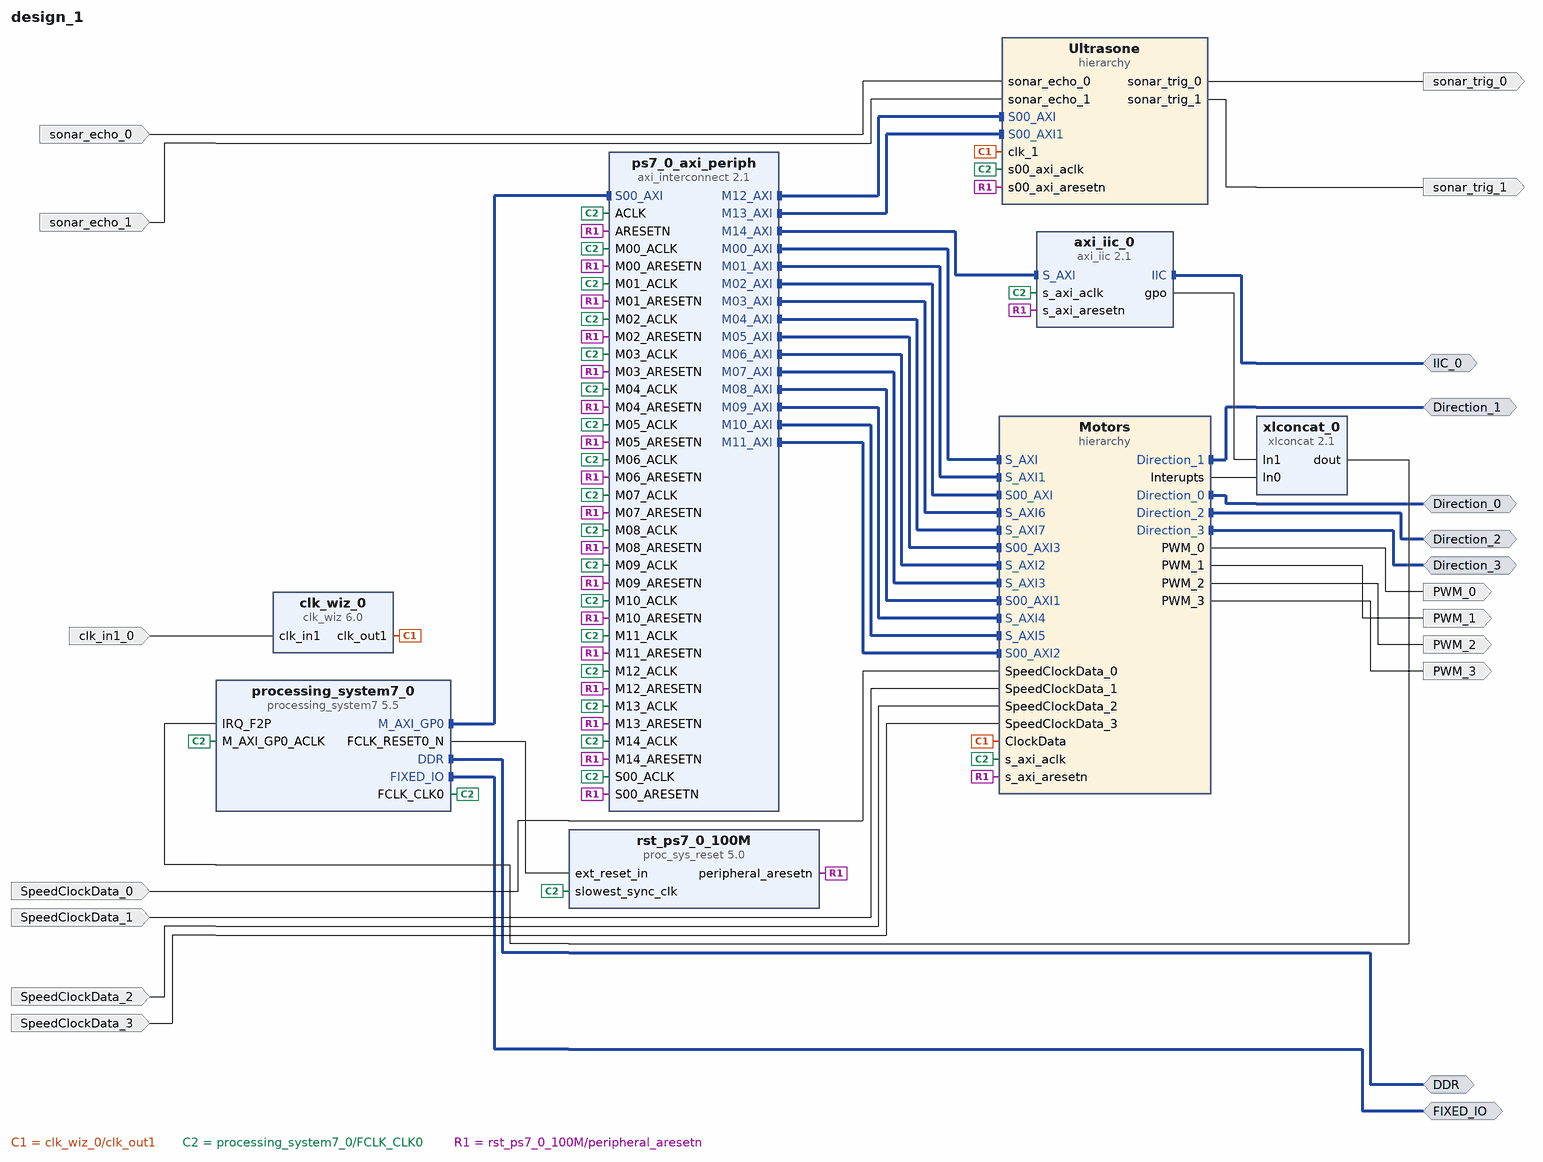
[diagram p0: block diagram of the top level]
# Vivado block design design_1, xc7z020clg400-1, Vivado 2023.2
create_bd_design design_1

create_bd_intf_port -mode Master -vlnv xilinx.com:interface:gpio_rtl:1.0 Direction_0
create_bd_intf_port -mode Master -vlnv xilinx.com:interface:ddrx_rtl:1.0 DDR
create_bd_intf_port -mode Master -vlnv xilinx.com:display_processing_system7:fixedio_rtl:1.0 FIXED_IO
create_bd_intf_port -mode Master -vlnv xilinx.com:interface:gpio_rtl:1.0 Direction_1
create_bd_intf_port -mode Master -vlnv xilinx.com:interface:gpio_rtl:1.0 Direction_2
create_bd_intf_port -mode Master -vlnv xilinx.com:interface:gpio_rtl:1.0 Direction_3
create_bd_intf_port -mode Master -vlnv xilinx.com:interface:iic_rtl:1.0 IIC_0
create_bd_port -dir I SpeedClockData_0
create_bd_port -dir O sonar_trig_0
create_bd_port -dir I sonar_echo_0
create_bd_port -dir O sonar_trig_1
create_bd_port -dir I sonar_echo_1
create_bd_port -dir I -type clk clk_in1_0
set_property -dict {CONFIG.FREQ_HZ 125000000} [get_bd_ports clk_in1_0]
create_bd_port -dir O PWM_0
create_bd_port -dir O PWM_3
create_bd_port -dir O PWM_2
create_bd_port -dir O PWM_1
create_bd_port -dir I SpeedClockData_3
create_bd_port -dir I SpeedClockData_2
create_bd_port -dir I SpeedClockData_1

create_bd_cell -type ip -vlnv xilinx.com:ip:processing_system7:5.5 processing_system7_0
set_property -dict [list \
  CONFIG.PCW_APU_PERIPHERAL_FREQMHZ 650 \
  CONFIG.PCW_CRYSTAL_PERIPHERAL_FREQMHZ 50 \
  CONFIG.PCW_ENET0_ENET0_IO {MIO 16 .. 27} \
  CONFIG.PCW_ENET0_GRP_MDIO_ENABLE 1 \
  CONFIG.PCW_ENET0_GRP_MDIO_IO {MIO 52 .. 53} \
  CONFIG.PCW_ENET0_PERIPHERAL_ENABLE 1 \
  CONFIG.PCW_ENET0_RESET_ENABLE 1 \
  CONFIG.PCW_ENET0_RESET_IO {MIO 9} \
  CONFIG.PCW_ENET_RESET_ENABLE 1 \
  CONFIG.PCW_ENET_RESET_SELECT {Share reset pin} \
  CONFIG.PCW_FPGA0_PERIPHERAL_FREQMHZ 100 \
  CONFIG.PCW_FPGA1_PERIPHERAL_FREQMHZ 50 \
  CONFIG.PCW_GPIO_MIO_GPIO_ENABLE 1 \
  CONFIG.PCW_GPIO_MIO_GPIO_IO MIO \
  CONFIG.PCW_I2C_RESET_ENABLE 1 \
  CONFIG.PCW_IRQ_F2P_INTR 1 \
  CONFIG.PCW_M_AXI_GP0_FREQMHZ 10 \
  CONFIG.PCW_PERIPHERAL_BOARD_PRESET part0 \
  CONFIG.PCW_PRESET_BANK1_VOLTAGE {LVCMOS 1.8V} \
  CONFIG.PCW_QSPI_GRP_FBCLK_ENABLE 1 \
  CONFIG.PCW_QSPI_GRP_FBCLK_IO {MIO 8} \
  CONFIG.PCW_QSPI_GRP_SINGLE_SS_ENABLE 1 \
  CONFIG.PCW_QSPI_GRP_SINGLE_SS_IO {MIO 1 .. 6} \
  CONFIG.PCW_QSPI_PERIPHERAL_ENABLE 1 \
  CONFIG.PCW_QSPI_QSPI_IO {MIO 1 .. 6} \
  CONFIG.PCW_SD0_GRP_CD_ENABLE 1 \
  CONFIG.PCW_SD0_GRP_CD_IO {MIO 47} \
  CONFIG.PCW_SD0_GRP_WP_ENABLE 0 \
  CONFIG.PCW_SD0_PERIPHERAL_ENABLE 1 \
  CONFIG.PCW_SD0_SD0_IO {MIO 40 .. 45} \
  CONFIG.PCW_SDIO_PERIPHERAL_FREQMHZ 50 \
  CONFIG.PCW_SINGLE_QSPI_DATA_MODE x4 \
  CONFIG.PCW_UART0_PERIPHERAL_ENABLE 1 \
  CONFIG.PCW_UART0_UART0_IO {MIO 14 .. 15} \
  CONFIG.PCW_UART1_PERIPHERAL_ENABLE 0 \
  CONFIG.PCW_UART_PERIPHERAL_FREQMHZ 100 \
  CONFIG.PCW_UIPARAM_DDR_BUS_WIDTH {16 Bit} \
  CONFIG.PCW_UIPARAM_DDR_FREQ_MHZ 525 \
  CONFIG.PCW_UIPARAM_DDR_PARTNO {MT41J256M16 RE-125} \
  CONFIG.PCW_USB0_PERIPHERAL_ENABLE 1 \
  CONFIG.PCW_USB0_RESET_ENABLE 1 \
  CONFIG.PCW_USB0_RESET_IO {MIO 46} \
  CONFIG.PCW_USB0_USB0_IO {MIO 28 .. 39} \
  CONFIG.PCW_USB_RESET_ENABLE 1 \
  CONFIG.PCW_USB_RESET_SELECT {Share reset pin} \
  CONFIG.PCW_USE_FABRIC_INTERRUPT 1 \
] [get_bd_cells processing_system7_0]
# 495 more settings of processing_system7_0 are not shown: defaults, MIO pin electricals, DDR timing, and values the tool derives
create_bd_cell -type ip -vlnv xilinx.com:ip:proc_sys_reset:5.0 rst_ps7_0_100M
create_bd_cell -type ip -vlnv xilinx.com:ip:axi_interconnect:2.1 ps7_0_axi_periph
set_property -dict {CONFIG.NUM_MI 15} [get_bd_cells ps7_0_axi_periph]
create_bd_cell -type hier Ultrasone
create_bd_cell -type ip -vlnv xilinx.com:ip:clk_wiz:6.0 clk_wiz_0
set_property -dict [list \
  CONFIG.CLKIN1_JITTER_PS 80.0 \
  CONFIG.CLKOUT1_JITTER 124.615 \
  CONFIG.CLKOUT1_PHASE_ERROR 96.948 \
  CONFIG.MMCM_CLKFBOUT_MULT_F 8.000 \
  CONFIG.MMCM_CLKIN1_PERIOD 8.000 \
  CONFIG.PRIM_IN_FREQ 125.000 \
  CONFIG.USE_LOCKED false \
  CONFIG.USE_RESET false \
] [get_bd_cells clk_wiz_0]
create_bd_cell -type ip -vlnv xilinx.com:ip:axi_iic:2.1 axi_iic_0
create_bd_cell -type hier Motors
create_bd_cell -type ip -vlnv xilinx.com:ip:xlconcat:2.1 xlconcat_0
set_property -dict {CONFIG.IN0_WIDTH 4} [get_bd_cells xlconcat_0]

# ---- hierarchy /Ultrasone ----
current_bd_instance /Ultrasone
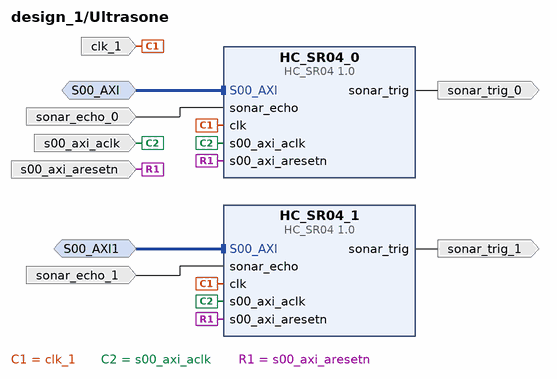
[diagram p1: block diagram inside /Ultrasone]
create_bd_intf_pin -mode Slave -vlnv xilinx.com:interface:aximm_rtl:1.0 S00_AXI
create_bd_intf_pin -mode Slave -vlnv xilinx.com:interface:aximm_rtl:1.0 S00_AXI1
create_bd_pin -dir I -type clk clk_1
create_bd_pin -dir O sonar_trig_0
create_bd_pin -dir I sonar_echo_0
create_bd_pin -dir I -type clk s00_axi_aclk
create_bd_pin -dir I -type rst s00_axi_aresetn
create_bd_pin -dir O sonar_trig_1
create_bd_pin -dir I sonar_echo_1

create_bd_cell -type ip -vlnv xilinx.com:user:HC_SR04:1.0 HC_SR04_0
create_bd_cell -type ip -vlnv xilinx.com:user:HC_SR04:1.0 HC_SR04_1

# ---- hierarchy /Motors ----
current_bd_instance /Motors
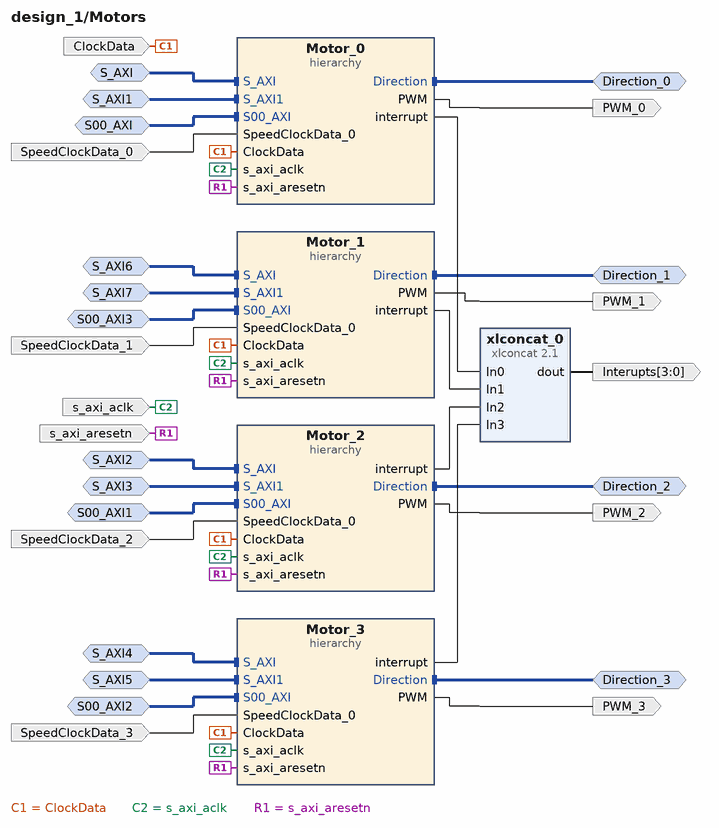
[diagram p2: block diagram inside /Motors]
create_bd_intf_pin -mode Slave -vlnv xilinx.com:interface:aximm_rtl:1.0 S00_AXI
create_bd_intf_pin -mode Slave -vlnv xilinx.com:interface:aximm_rtl:1.0 S_AXI
create_bd_intf_pin -mode Master -vlnv xilinx.com:interface:gpio_rtl:1.0 Direction_0
create_bd_intf_pin -mode Slave -vlnv xilinx.com:interface:aximm_rtl:1.0 S_AXI1
create_bd_intf_pin -mode Slave -vlnv xilinx.com:interface:aximm_rtl:1.0 S00_AXI1
create_bd_intf_pin -mode Slave -vlnv xilinx.com:interface:aximm_rtl:1.0 S_AXI2
create_bd_intf_pin -mode Master -vlnv xilinx.com:interface:gpio_rtl:1.0 Direction_2
create_bd_intf_pin -mode Slave -vlnv xilinx.com:interface:aximm_rtl:1.0 S_AXI3
create_bd_intf_pin -mode Slave -vlnv xilinx.com:interface:aximm_rtl:1.0 S00_AXI2
create_bd_intf_pin -mode Slave -vlnv xilinx.com:interface:aximm_rtl:1.0 S_AXI4
create_bd_intf_pin -mode Master -vlnv xilinx.com:interface:gpio_rtl:1.0 Direction_3
create_bd_intf_pin -mode Slave -vlnv xilinx.com:interface:aximm_rtl:1.0 S_AXI5
create_bd_intf_pin -mode Slave -vlnv xilinx.com:interface:aximm_rtl:1.0 S00_AXI3
create_bd_intf_pin -mode Slave -vlnv xilinx.com:interface:aximm_rtl:1.0 S_AXI6
create_bd_intf_pin -mode Master -vlnv xilinx.com:interface:gpio_rtl:1.0 Direction_1
create_bd_intf_pin -mode Slave -vlnv xilinx.com:interface:aximm_rtl:1.0 S_AXI7
create_bd_pin -dir O -from 3 -to 0 Interupts
create_bd_pin -dir I SpeedClockData_0
create_bd_pin -dir I ClockData
create_bd_pin -dir I -type clk s_axi_aclk
create_bd_pin -dir I -type rst s_axi_aresetn
create_bd_pin -dir O PWM_0
create_bd_pin -dir I SpeedClockData_2
create_bd_pin -dir O PWM_2
create_bd_pin -dir I SpeedClockData_3
create_bd_pin -dir O PWM_3
create_bd_pin -dir I SpeedClockData_1
create_bd_pin -dir O PWM_1

create_bd_cell -type ip -vlnv xilinx.com:ip:xlconcat:2.1 xlconcat_0
set_property -dict {CONFIG.NUM_PORTS 4} [get_bd_cells xlconcat_0]
create_bd_cell -type hier Motor_0
create_bd_cell -type hier Motor_2
create_bd_cell -type hier Motor_3
create_bd_cell -type hier Motor_1

# ---- hierarchy /Motors/Motor_0 ----
current_bd_instance /Motors/Motor_0
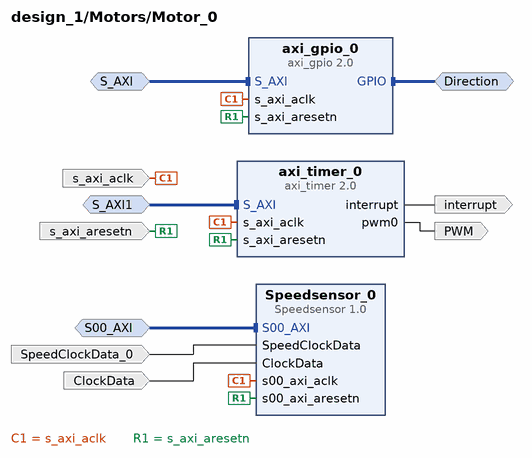
[diagram p3: block diagram inside /Motors/Motor_0]
create_bd_intf_pin -mode Slave -vlnv xilinx.com:interface:aximm_rtl:1.0 S00_AXI
create_bd_intf_pin -mode Slave -vlnv xilinx.com:interface:aximm_rtl:1.0 S_AXI
create_bd_intf_pin -mode Master -vlnv xilinx.com:interface:gpio_rtl:1.0 Direction
create_bd_intf_pin -mode Slave -vlnv xilinx.com:interface:aximm_rtl:1.0 S_AXI1
create_bd_pin -dir I SpeedClockData_0
create_bd_pin -dir I ClockData
create_bd_pin -dir I -type clk s_axi_aclk
create_bd_pin -dir I -type rst s_axi_aresetn
create_bd_pin -dir O PWM
create_bd_pin -dir O -type intr interrupt

create_bd_cell -type ip -vlnv xilinx.com:user:Speedsensor:1.0 Speedsensor_0
create_bd_cell -type ip -vlnv xilinx.com:ip:axi_gpio:2.0 axi_gpio_0
set_property -dict {CONFIG.C_ALL_OUTPUTS 1 CONFIG.C_GPIO_WIDTH 2} [get_bd_cells axi_gpio_0]
create_bd_cell -type ip -vlnv xilinx.com:ip:axi_timer:2.0 axi_timer_0
set_property -dict {CONFIG.enable_timer2 1} [get_bd_cells axi_timer_0]

# ---- hierarchy /Motors/Motor_2 ----
current_bd_instance /Motors/Motor_2
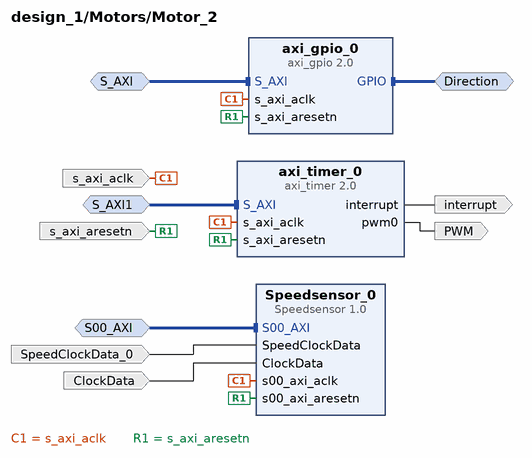
[diagram p4: block diagram inside /Motors/Motor_2]
create_bd_intf_pin -mode Slave -vlnv xilinx.com:interface:aximm_rtl:1.0 S00_AXI
create_bd_intf_pin -mode Slave -vlnv xilinx.com:interface:aximm_rtl:1.0 S_AXI
create_bd_intf_pin -mode Master -vlnv xilinx.com:interface:gpio_rtl:1.0 Direction
create_bd_intf_pin -mode Slave -vlnv xilinx.com:interface:aximm_rtl:1.0 S_AXI1
create_bd_pin -dir I SpeedClockData_0
create_bd_pin -dir I ClockData
create_bd_pin -dir I -type clk s_axi_aclk
create_bd_pin -dir I -type rst s_axi_aresetn
create_bd_pin -dir O PWM
create_bd_pin -dir O -type intr interrupt

create_bd_cell -type ip -vlnv xilinx.com:user:Speedsensor:1.0 Speedsensor_0
create_bd_cell -type ip -vlnv xilinx.com:ip:axi_gpio:2.0 axi_gpio_0
set_property -dict {CONFIG.C_ALL_OUTPUTS 1 CONFIG.C_GPIO_WIDTH 2} [get_bd_cells axi_gpio_0]
create_bd_cell -type ip -vlnv xilinx.com:ip:axi_timer:2.0 axi_timer_0
set_property -dict {CONFIG.enable_timer2 1} [get_bd_cells axi_timer_0]

# ---- hierarchy /Motors/Motor_3 ----
current_bd_instance /Motors/Motor_3
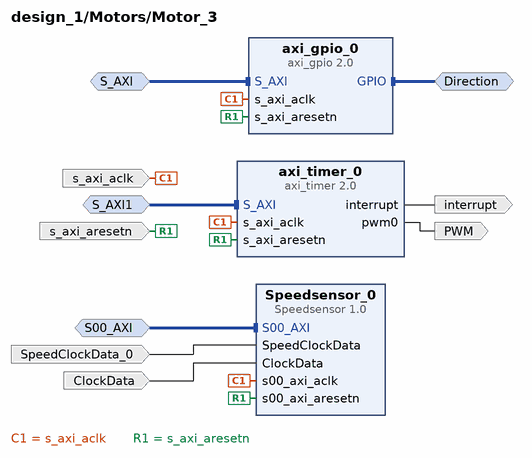
[diagram p5: block diagram inside /Motors/Motor_3]
create_bd_intf_pin -mode Slave -vlnv xilinx.com:interface:aximm_rtl:1.0 S00_AXI
create_bd_intf_pin -mode Slave -vlnv xilinx.com:interface:aximm_rtl:1.0 S_AXI
create_bd_intf_pin -mode Master -vlnv xilinx.com:interface:gpio_rtl:1.0 Direction
create_bd_intf_pin -mode Slave -vlnv xilinx.com:interface:aximm_rtl:1.0 S_AXI1
create_bd_pin -dir I SpeedClockData_0
create_bd_pin -dir I ClockData
create_bd_pin -dir I -type clk s_axi_aclk
create_bd_pin -dir I -type rst s_axi_aresetn
create_bd_pin -dir O PWM
create_bd_pin -dir O -type intr interrupt

create_bd_cell -type ip -vlnv xilinx.com:user:Speedsensor:1.0 Speedsensor_0
create_bd_cell -type ip -vlnv xilinx.com:ip:axi_gpio:2.0 axi_gpio_0
set_property -dict {CONFIG.C_ALL_OUTPUTS 1 CONFIG.C_GPIO_WIDTH 2} [get_bd_cells axi_gpio_0]
create_bd_cell -type ip -vlnv xilinx.com:ip:axi_timer:2.0 axi_timer_0
set_property -dict {CONFIG.enable_timer2 1} [get_bd_cells axi_timer_0]

# ---- hierarchy /Motors/Motor_1 ----
current_bd_instance /Motors/Motor_1
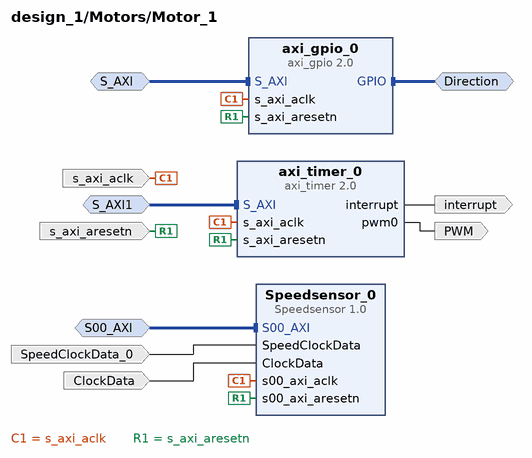
[diagram p6: block diagram inside /Motors/Motor_1]
create_bd_intf_pin -mode Slave -vlnv xilinx.com:interface:aximm_rtl:1.0 S00_AXI
create_bd_intf_pin -mode Slave -vlnv xilinx.com:interface:aximm_rtl:1.0 S_AXI
create_bd_intf_pin -mode Master -vlnv xilinx.com:interface:gpio_rtl:1.0 Direction
create_bd_intf_pin -mode Slave -vlnv xilinx.com:interface:aximm_rtl:1.0 S_AXI1
create_bd_pin -dir I SpeedClockData_0
create_bd_pin -dir I ClockData
create_bd_pin -dir I -type clk s_axi_aclk
create_bd_pin -dir I -type rst s_axi_aresetn
create_bd_pin -dir O PWM
create_bd_pin -dir O -type intr interrupt

create_bd_cell -type ip -vlnv xilinx.com:user:Speedsensor:1.0 Speedsensor_0
create_bd_cell -type ip -vlnv xilinx.com:ip:axi_gpio:2.0 axi_gpio_0
set_property -dict {CONFIG.C_ALL_OUTPUTS 1 CONFIG.C_GPIO_WIDTH 2} [get_bd_cells axi_gpio_0]
create_bd_cell -type ip -vlnv xilinx.com:ip:axi_timer:2.0 axi_timer_0
set_property -dict {CONFIG.enable_timer2 1} [get_bd_cells axi_timer_0]

# ---- connections ----

current_bd_instance /Ultrasone
connect_bd_intf_net [get_bd_intf_pins S00_AXI] [get_bd_intf_pins HC_SR04_0/S00_AXI]
connect_bd_intf_net [get_bd_intf_pins S00_AXI1] [get_bd_intf_pins HC_SR04_1/S00_AXI]
connect_bd_net [get_bd_pins HC_SR04_0/sonar_trig] [get_bd_pins sonar_trig_0]
connect_bd_net [get_bd_pins HC_SR04_1/sonar_trig] [get_bd_pins sonar_trig_1]
connect_bd_net -net clk_1_1 [get_bd_pins clk_1] [get_bd_pins HC_SR04_1/clk] [get_bd_pins HC_SR04_0/clk]
connect_bd_net -net processing_system7_0_FCLK_CLK0 [get_bd_pins s00_axi_aclk] \
  [get_bd_pins HC_SR04_1/s00_axi_aclk] [get_bd_pins HC_SR04_0/s00_axi_aclk]
connect_bd_net -net rst_ps7_0_100M_peripheral_aresetn [get_bd_pins s00_axi_aresetn] \
  [get_bd_pins HC_SR04_1/s00_axi_aresetn] [get_bd_pins HC_SR04_0/s00_axi_aresetn]
connect_bd_net -net sonar_echo_0_1 [get_bd_pins sonar_echo_0] [get_bd_pins HC_SR04_0/sonar_echo]
connect_bd_net -net sonar_echo_1_1 [get_bd_pins sonar_echo_1] [get_bd_pins HC_SR04_1/sonar_echo]

current_bd_instance /Motors
connect_bd_intf_net [get_bd_intf_pins Direction_1] [get_bd_intf_pins Motor_1/Direction]
connect_bd_intf_net [get_bd_intf_pins Direction_2] [get_bd_intf_pins Motor_2/Direction]
connect_bd_intf_net [get_bd_intf_pins Direction_3] [get_bd_intf_pins Motor_3/Direction]
connect_bd_intf_net -intf_net axi_gpio_0_GPIO [get_bd_intf_pins Direction_0] [get_bd_intf_pins Motor_0/Direction]
connect_bd_intf_net [get_bd_intf_pins S_AXI] [get_bd_intf_pins Motor_0/S_AXI]
connect_bd_intf_net [get_bd_intf_pins S_AXI1] [get_bd_intf_pins Motor_0/S_AXI1]
connect_bd_intf_net [get_bd_intf_pins S00_AXI] [get_bd_intf_pins Motor_0/S00_AXI]
connect_bd_intf_net [get_bd_intf_pins S_AXI6] [get_bd_intf_pins Motor_1/S_AXI]
connect_bd_intf_net [get_bd_intf_pins S_AXI7] [get_bd_intf_pins Motor_1/S_AXI1]
connect_bd_intf_net [get_bd_intf_pins S00_AXI3] [get_bd_intf_pins Motor_1/S00_AXI]
connect_bd_intf_net [get_bd_intf_pins S_AXI2] [get_bd_intf_pins Motor_2/S_AXI]
connect_bd_intf_net [get_bd_intf_pins S_AXI3] [get_bd_intf_pins Motor_2/S_AXI1]
connect_bd_intf_net [get_bd_intf_pins S00_AXI1] [get_bd_intf_pins Motor_2/S00_AXI]
connect_bd_intf_net [get_bd_intf_pins S_AXI4] [get_bd_intf_pins Motor_3/S_AXI]
connect_bd_intf_net [get_bd_intf_pins S_AXI5] [get_bd_intf_pins Motor_3/S_AXI1]
connect_bd_intf_net [get_bd_intf_pins S00_AXI2] [get_bd_intf_pins Motor_3/S00_AXI]
connect_bd_net [get_bd_pins Motor_0/PWM] [get_bd_pins PWM_0]
connect_bd_net [get_bd_pins Motor_0/interrupt] [get_bd_pins xlconcat_0/In0]
connect_bd_net [get_bd_pins Motor_1/PWM] [get_bd_pins PWM_1]
connect_bd_net [get_bd_pins Motor_1/interrupt] [get_bd_pins xlconcat_0/In1]
connect_bd_net [get_bd_pins Motor_2/PWM] [get_bd_pins PWM_2]
connect_bd_net [get_bd_pins Motor_2/interrupt] [get_bd_pins xlconcat_0/In2]
connect_bd_net [get_bd_pins Motor_3/PWM] [get_bd_pins PWM_3]
connect_bd_net [get_bd_pins Motor_3/interrupt] [get_bd_pins xlconcat_0/In3]
connect_bd_net -net SpeedClockData_0_1 [get_bd_pins SpeedClockData_0] [get_bd_pins Motor_0/SpeedClockData_0]
connect_bd_net -net SpeedClockData_1_1 [get_bd_pins SpeedClockData_1] [get_bd_pins Motor_1/SpeedClockData_0]
connect_bd_net -net SpeedClockData_2_1 [get_bd_pins SpeedClockData_2] [get_bd_pins Motor_2/SpeedClockData_0]
connect_bd_net -net SpeedClockData_3_1 [get_bd_pins SpeedClockData_3] [get_bd_pins Motor_3/SpeedClockData_0]
connect_bd_net -net clk_1_1 [get_bd_pins ClockData] \
  [get_bd_pins Motor_3/ClockData] [get_bd_pins Motor_2/ClockData] [get_bd_pins Motor_1/ClockData] \
  [get_bd_pins Motor_0/ClockData]
connect_bd_net -net processing_system7_0_FCLK_CLK0 [get_bd_pins s_axi_aclk] \
  [get_bd_pins Motor_3/s_axi_aclk] [get_bd_pins Motor_2/s_axi_aclk] [get_bd_pins Motor_1/s_axi_aclk] \
  [get_bd_pins Motor_0/s_axi_aclk]
connect_bd_net -net rst_ps7_0_100M_peripheral_aresetn [get_bd_pins s_axi_aresetn] \
  [get_bd_pins Motor_3/s_axi_aresetn] [get_bd_pins Motor_2/s_axi_aresetn] [get_bd_pins Motor_1/s_axi_aresetn] \
  [get_bd_pins Motor_0/s_axi_aresetn]
connect_bd_net [get_bd_pins xlconcat_0/dout] [get_bd_pins Interupts]

current_bd_instance /Motors/Motor_0
connect_bd_intf_net [get_bd_intf_pins Direction] [get_bd_intf_pins axi_gpio_0/GPIO]
connect_bd_intf_net [get_bd_intf_pins S_AXI] [get_bd_intf_pins axi_gpio_0/S_AXI]
connect_bd_intf_net [get_bd_intf_pins S_AXI1] [get_bd_intf_pins axi_timer_0/S_AXI]
connect_bd_intf_net [get_bd_intf_pins S00_AXI] [get_bd_intf_pins Speedsensor_0/S00_AXI]
connect_bd_net -net SpeedClockData_0_1 [get_bd_pins SpeedClockData_0] [get_bd_pins Speedsensor_0/SpeedClockData]
connect_bd_net [get_bd_pins axi_timer_0/interrupt] [get_bd_pins interrupt]
connect_bd_net [get_bd_pins axi_timer_0/pwm0] [get_bd_pins PWM]
connect_bd_net -net clk_1_1 [get_bd_pins ClockData] [get_bd_pins Speedsensor_0/ClockData]
connect_bd_net -net processing_system7_0_FCLK_CLK0 [get_bd_pins s_axi_aclk] \
  [get_bd_pins axi_gpio_0/s_axi_aclk] [get_bd_pins axi_timer_0/s_axi_aclk] [get_bd_pins Speedsensor_0/s00_axi_aclk]
connect_bd_net -net rst_ps7_0_100M_peripheral_aresetn [get_bd_pins s_axi_aresetn] \
  [get_bd_pins axi_gpio_0/s_axi_aresetn] [get_bd_pins axi_timer_0/s_axi_aresetn] [get_bd_pins Speedsensor_0/s00_axi_aresetn]

current_bd_instance /Motors/Motor_2
connect_bd_intf_net [get_bd_intf_pins Direction] [get_bd_intf_pins axi_gpio_0/GPIO]
connect_bd_intf_net [get_bd_intf_pins S_AXI] [get_bd_intf_pins axi_gpio_0/S_AXI]
connect_bd_intf_net [get_bd_intf_pins S_AXI1] [get_bd_intf_pins axi_timer_0/S_AXI]
connect_bd_intf_net [get_bd_intf_pins S00_AXI] [get_bd_intf_pins Speedsensor_0/S00_AXI]
connect_bd_net -net SpeedClockData_0_1 [get_bd_pins SpeedClockData_0] [get_bd_pins Speedsensor_0/SpeedClockData]
connect_bd_net [get_bd_pins axi_timer_0/interrupt] [get_bd_pins interrupt]
connect_bd_net [get_bd_pins axi_timer_0/pwm0] [get_bd_pins PWM]
connect_bd_net -net clk_1_1 [get_bd_pins ClockData] [get_bd_pins Speedsensor_0/ClockData]
connect_bd_net -net processing_system7_0_FCLK_CLK0 [get_bd_pins s_axi_aclk] \
  [get_bd_pins axi_gpio_0/s_axi_aclk] [get_bd_pins axi_timer_0/s_axi_aclk] [get_bd_pins Speedsensor_0/s00_axi_aclk]
connect_bd_net [get_bd_pins s_axi_aresetn] \
  [get_bd_pins axi_gpio_0/s_axi_aresetn] [get_bd_pins axi_timer_0/s_axi_aresetn] [get_bd_pins Speedsensor_0/s00_axi_aresetn]

current_bd_instance /Motors/Motor_3
connect_bd_intf_net [get_bd_intf_pins Direction] [get_bd_intf_pins axi_gpio_0/GPIO]
connect_bd_intf_net [get_bd_intf_pins S_AXI] [get_bd_intf_pins axi_gpio_0/S_AXI]
connect_bd_intf_net [get_bd_intf_pins S_AXI1] [get_bd_intf_pins axi_timer_0/S_AXI]
connect_bd_intf_net [get_bd_intf_pins S00_AXI] [get_bd_intf_pins Speedsensor_0/S00_AXI]
connect_bd_net -net SpeedClockData_0_1 [get_bd_pins SpeedClockData_0] [get_bd_pins Speedsensor_0/SpeedClockData]
connect_bd_net [get_bd_pins axi_timer_0/interrupt] [get_bd_pins interrupt]
connect_bd_net [get_bd_pins axi_timer_0/pwm0] [get_bd_pins PWM]
connect_bd_net -net clk_1_1 [get_bd_pins ClockData] [get_bd_pins Speedsensor_0/ClockData]
connect_bd_net -net processing_system7_0_FCLK_CLK0 [get_bd_pins s_axi_aclk] \
  [get_bd_pins axi_gpio_0/s_axi_aclk] [get_bd_pins axi_timer_0/s_axi_aclk] [get_bd_pins Speedsensor_0/s00_axi_aclk]
connect_bd_net [get_bd_pins s_axi_aresetn] \
  [get_bd_pins axi_gpio_0/s_axi_aresetn] [get_bd_pins axi_timer_0/s_axi_aresetn] [get_bd_pins Speedsensor_0/s00_axi_aresetn]

current_bd_instance /Motors/Motor_1
connect_bd_intf_net [get_bd_intf_pins Direction] [get_bd_intf_pins axi_gpio_0/GPIO]
connect_bd_intf_net [get_bd_intf_pins S_AXI] [get_bd_intf_pins axi_gpio_0/S_AXI]
connect_bd_intf_net [get_bd_intf_pins S_AXI1] [get_bd_intf_pins axi_timer_0/S_AXI]
connect_bd_intf_net [get_bd_intf_pins S00_AXI] [get_bd_intf_pins Speedsensor_0/S00_AXI]
connect_bd_net -net SpeedClockData_0_1 [get_bd_pins SpeedClockData_0] [get_bd_pins Speedsensor_0/SpeedClockData]
connect_bd_net [get_bd_pins axi_timer_0/interrupt] [get_bd_pins interrupt]
connect_bd_net [get_bd_pins axi_timer_0/pwm0] [get_bd_pins PWM]
connect_bd_net -net clk_1_1 [get_bd_pins ClockData] [get_bd_pins Speedsensor_0/ClockData]
connect_bd_net -net processing_system7_0_FCLK_CLK0 [get_bd_pins s_axi_aclk] \
  [get_bd_pins axi_gpio_0/s_axi_aclk] [get_bd_pins axi_timer_0/s_axi_aclk] [get_bd_pins Speedsensor_0/s00_axi_aclk]
connect_bd_net [get_bd_pins s_axi_aresetn] \
  [get_bd_pins axi_gpio_0/s_axi_aresetn] [get_bd_pins axi_timer_0/s_axi_aresetn] [get_bd_pins Speedsensor_0/s00_axi_aresetn]

current_bd_instance /
connect_bd_intf_net -intf_net Motor_1_Direction [get_bd_intf_ports Direction_1] [get_bd_intf_pins Motors/Direction_1]
connect_bd_intf_net -intf_net Motor_2_Direction [get_bd_intf_ports Direction_2] [get_bd_intf_pins Motors/Direction_2]
connect_bd_intf_net -intf_net Motor_3_Direction [get_bd_intf_ports Direction_3] [get_bd_intf_pins Motors/Direction_3]
connect_bd_intf_net -intf_net axi_gpio_0_GPIO [get_bd_intf_ports Direction_0] [get_bd_intf_pins Motors/Direction_0]
connect_bd_intf_net [get_bd_intf_ports IIC_0] [get_bd_intf_pins axi_iic_0/IIC]
connect_bd_intf_net [get_bd_intf_ports DDR] [get_bd_intf_pins processing_system7_0/DDR]
connect_bd_intf_net [get_bd_intf_ports FIXED_IO] [get_bd_intf_pins processing_system7_0/FIXED_IO]
connect_bd_intf_net [get_bd_intf_pins processing_system7_0/M_AXI_GP0] [get_bd_intf_pins ps7_0_axi_periph/S00_AXI]
connect_bd_intf_net [get_bd_intf_pins ps7_0_axi_periph/M00_AXI] [get_bd_intf_pins Motors/S_AXI]
connect_bd_intf_net [get_bd_intf_pins ps7_0_axi_periph/M01_AXI] [get_bd_intf_pins Motors/S_AXI1]
connect_bd_intf_net [get_bd_intf_pins ps7_0_axi_periph/M02_AXI] [get_bd_intf_pins Motors/S00_AXI]
connect_bd_intf_net [get_bd_intf_pins ps7_0_axi_periph/M03_AXI] [get_bd_intf_pins Motors/S_AXI6]
connect_bd_intf_net [get_bd_intf_pins ps7_0_axi_periph/M04_AXI] [get_bd_intf_pins Motors/S_AXI7]
connect_bd_intf_net [get_bd_intf_pins ps7_0_axi_periph/M05_AXI] [get_bd_intf_pins Motors/S00_AXI3]
connect_bd_intf_net [get_bd_intf_pins ps7_0_axi_periph/M06_AXI] [get_bd_intf_pins Motors/S_AXI2]
connect_bd_intf_net [get_bd_intf_pins ps7_0_axi_periph/M07_AXI] [get_bd_intf_pins Motors/S_AXI3]
connect_bd_intf_net [get_bd_intf_pins ps7_0_axi_periph/M08_AXI] [get_bd_intf_pins Motors/S00_AXI1]
connect_bd_intf_net [get_bd_intf_pins ps7_0_axi_periph/M09_AXI] [get_bd_intf_pins Motors/S_AXI4]
connect_bd_intf_net [get_bd_intf_pins ps7_0_axi_periph/M10_AXI] [get_bd_intf_pins Motors/S_AXI5]
connect_bd_intf_net [get_bd_intf_pins ps7_0_axi_periph/M11_AXI] [get_bd_intf_pins Motors/S00_AXI2]
connect_bd_intf_net [get_bd_intf_pins ps7_0_axi_periph/M12_AXI] [get_bd_intf_pins Ultrasone/S00_AXI]
connect_bd_intf_net [get_bd_intf_pins ps7_0_axi_periph/M13_AXI] [get_bd_intf_pins Ultrasone/S00_AXI1]
connect_bd_intf_net [get_bd_intf_pins ps7_0_axi_periph/M14_AXI] [get_bd_intf_pins axi_iic_0/S_AXI]
connect_bd_net -net HC_SR04_0_sonar_trig [get_bd_pins Ultrasone/sonar_trig_0] [get_bd_ports sonar_trig_0]
connect_bd_net -net HC_SR04_1_sonar_trig [get_bd_pins Ultrasone/sonar_trig_1] [get_bd_ports sonar_trig_1]
connect_bd_net -net Motor_0_PWM [get_bd_pins Motors/PWM_0] [get_bd_ports PWM_0]
connect_bd_net -net Motor_1_PWM [get_bd_pins Motors/PWM_1] [get_bd_ports PWM_1]
connect_bd_net -net Motor_2_PWM [get_bd_pins Motors/PWM_2] [get_bd_ports PWM_2]
connect_bd_net -net Motor_3_PWM [get_bd_pins Motors/PWM_3] [get_bd_ports PWM_3]
connect_bd_net [get_bd_pins Motors/Interupts] [get_bd_pins xlconcat_0/In0]
connect_bd_net -net SpeedClockData_0_1 [get_bd_ports SpeedClockData_0] [get_bd_pins Motors/SpeedClockData_0]
connect_bd_net -net SpeedClockData_1_1 [get_bd_ports SpeedClockData_1] [get_bd_pins Motors/SpeedClockData_1]
connect_bd_net -net SpeedClockData_2_1 [get_bd_ports SpeedClockData_2] [get_bd_pins Motors/SpeedClockData_2]
connect_bd_net -net SpeedClockData_3_1 [get_bd_ports SpeedClockData_3] [get_bd_pins Motors/SpeedClockData_3]
connect_bd_net [get_bd_pins axi_iic_0/gpo] [get_bd_pins xlconcat_0/In1]
connect_bd_net -net clk_1_1 [get_bd_pins clk_wiz_0/clk_out1] [get_bd_pins Ultrasone/clk_1] [get_bd_pins Motors/ClockData]
connect_bd_net -net clk_in1_0_1 [get_bd_ports clk_in1_0] [get_bd_pins clk_wiz_0/clk_in1]
connect_bd_net [get_bd_pins processing_system7_0/FCLK_CLK0] \
  [get_bd_pins processing_system7_0/M_AXI_GP0_ACLK] [get_bd_pins rst_ps7_0_100M/slowest_sync_clk] \
  [get_bd_pins ps7_0_axi_periph/S00_ACLK] [get_bd_pins ps7_0_axi_periph/M00_ACLK] [get_bd_pins ps7_0_axi_periph/ACLK] \
  [get_bd_pins ps7_0_axi_periph/M01_ACLK] [get_bd_pins ps7_0_axi_periph/M02_ACLK] [get_bd_pins ps7_0_axi_periph/M03_ACLK] \
  [get_bd_pins ps7_0_axi_periph/M04_ACLK] [get_bd_pins ps7_0_axi_periph/M05_ACLK] [get_bd_pins ps7_0_axi_periph/M06_ACLK] \
  [get_bd_pins ps7_0_axi_periph/M07_ACLK] [get_bd_pins ps7_0_axi_periph/M08_ACLK] [get_bd_pins ps7_0_axi_periph/M09_ACLK] \
  [get_bd_pins ps7_0_axi_periph/M10_ACLK] [get_bd_pins ps7_0_axi_periph/M11_ACLK] [get_bd_pins ps7_0_axi_periph/M12_ACLK] \
  [get_bd_pins ps7_0_axi_periph/M13_ACLK] [get_bd_pins Ultrasone/s00_axi_aclk] [get_bd_pins axi_iic_0/s_axi_aclk] \
  [get_bd_pins ps7_0_axi_periph/M14_ACLK] [get_bd_pins Motors/s_axi_aclk]
connect_bd_net [get_bd_pins processing_system7_0/FCLK_RESET0_N] [get_bd_pins rst_ps7_0_100M/ext_reset_in]
connect_bd_net [get_bd_pins rst_ps7_0_100M/peripheral_aresetn] \
  [get_bd_pins ps7_0_axi_periph/S00_ARESETN] [get_bd_pins ps7_0_axi_periph/M00_ARESETN] \
  [get_bd_pins ps7_0_axi_periph/ARESETN] [get_bd_pins ps7_0_axi_periph/M01_ARESETN] \
  [get_bd_pins ps7_0_axi_periph/M02_ARESETN] [get_bd_pins ps7_0_axi_periph/M03_ARESETN] \
  [get_bd_pins ps7_0_axi_periph/M04_ARESETN] [get_bd_pins ps7_0_axi_periph/M05_ARESETN] \
  [get_bd_pins ps7_0_axi_periph/M06_ARESETN] [get_bd_pins ps7_0_axi_periph/M07_ARESETN] \
  [get_bd_pins ps7_0_axi_periph/M08_ARESETN] [get_bd_pins ps7_0_axi_periph/M09_ARESETN] \
  [get_bd_pins ps7_0_axi_periph/M10_ARESETN] [get_bd_pins ps7_0_axi_periph/M11_ARESETN] \
  [get_bd_pins ps7_0_axi_periph/M12_ARESETN] [get_bd_pins ps7_0_axi_periph/M13_ARESETN] \
  [get_bd_pins Ultrasone/s00_axi_aresetn] [get_bd_pins axi_iic_0/s_axi_aresetn] [get_bd_pins ps7_0_axi_periph/M14_ARESETN] \
  [get_bd_pins Motors/s_axi_aresetn]
connect_bd_net -net sonar_echo_0_1 [get_bd_ports sonar_echo_0] [get_bd_pins Ultrasone/sonar_echo_0]
connect_bd_net -net sonar_echo_1_1 [get_bd_ports sonar_echo_1] [get_bd_pins Ultrasone/sonar_echo_1]
connect_bd_net [get_bd_pins xlconcat_0/dout] [get_bd_pins processing_system7_0/IRQ_F2P]

# ---- address map ----
assign_bd_address -offset 0x41200000 -range 64K -target_address_space [get_bd_addr_spaces processing_system7_0/Data] [get_bd_addr_segs Motors/Motor_0/axi_gpio_0/S_AXI/Reg]
assign_bd_address -offset 0x41210000 -range 64K -target_address_space [get_bd_addr_spaces processing_system7_0/Data] [get_bd_addr_segs Motors/Motor_1/axi_gpio_0/S_AXI/Reg]
assign_bd_address -offset 0x41220000 -range 64K -target_address_space [get_bd_addr_spaces processing_system7_0/Data] [get_bd_addr_segs Motors/Motor_2/axi_gpio_0/S_AXI/Reg]
assign_bd_address -offset 0x41230000 -range 64K -target_address_space [get_bd_addr_spaces processing_system7_0/Data] [get_bd_addr_segs Motors/Motor_3/axi_gpio_0/S_AXI/Reg]
assign_bd_address -offset 0x41600000 -range 64K -target_address_space [get_bd_addr_spaces processing_system7_0/Data] [get_bd_addr_segs axi_iic_0/S_AXI/Reg]
assign_bd_address -offset 0x42800000 -range 64K -target_address_space [get_bd_addr_spaces processing_system7_0/Data] [get_bd_addr_segs Motors/Motor_0/axi_timer_0/S_AXI/Reg]
assign_bd_address -offset 0x42810000 -range 64K -target_address_space [get_bd_addr_spaces processing_system7_0/Data] [get_bd_addr_segs Motors/Motor_1/axi_timer_0/S_AXI/Reg]
assign_bd_address -offset 0x42820000 -range 64K -target_address_space [get_bd_addr_spaces processing_system7_0/Data] [get_bd_addr_segs Motors/Motor_2/axi_timer_0/S_AXI/Reg]
assign_bd_address -offset 0x42830000 -range 64K -target_address_space [get_bd_addr_spaces processing_system7_0/Data] [get_bd_addr_segs Motors/Motor_3/axi_timer_0/S_AXI/Reg]
assign_bd_address -offset 0x43C00000 -range 64K -target_address_space [get_bd_addr_spaces processing_system7_0/Data] [get_bd_addr_segs Motors/Motor_0/Speedsensor_0/S00_AXI/S00_AXI_reg]
assign_bd_address -offset 0x43C10000 -range 64K -target_address_space [get_bd_addr_spaces processing_system7_0/Data] [get_bd_addr_segs Motors/Motor_1/Speedsensor_0/S00_AXI/S00_AXI_reg]
assign_bd_address -offset 0x43C20000 -range 64K -target_address_space [get_bd_addr_spaces processing_system7_0/Data] [get_bd_addr_segs Motors/Motor_2/Speedsensor_0/S00_AXI/S00_AXI_reg]
assign_bd_address -offset 0x43C30000 -range 64K -target_address_space [get_bd_addr_spaces processing_system7_0/Data] [get_bd_addr_segs Motors/Motor_3/Speedsensor_0/S00_AXI/S00_AXI_reg]
assign_bd_address -offset 0x43C40000 -range 64K -target_address_space [get_bd_addr_spaces processing_system7_0/Data] [get_bd_addr_segs Ultrasone/HC_SR04_0/S00_AXI/S00_AXI_reg]
assign_bd_address -offset 0x43C50000 -range 64K -target_address_space [get_bd_addr_spaces processing_system7_0/Data] [get_bd_addr_segs Ultrasone/HC_SR04_1/S00_AXI/S00_AXI_reg]

validate_bd_design
save_bd_design
